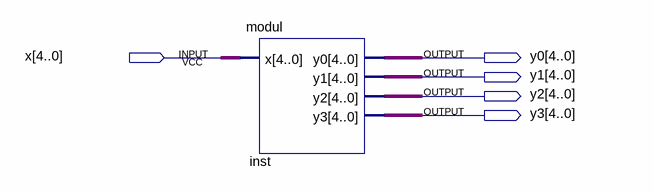
[diagram p0: schematic sheet]
// Quartus schematic tester.bdf as structural Verilog: 1 symbols, 5 pins
module tester (
  input  [4:0] x,
  output [4:0] y0,
  output [4:0] y1,
  output [4:0] y2,
  output [4:0] y3
);

  modul inst (.x(x), .y0(y0), .y1(y1), .y2(y2), .y3(y3));
endmodule
